# EAGLE design platform (EAGLE 5.04)
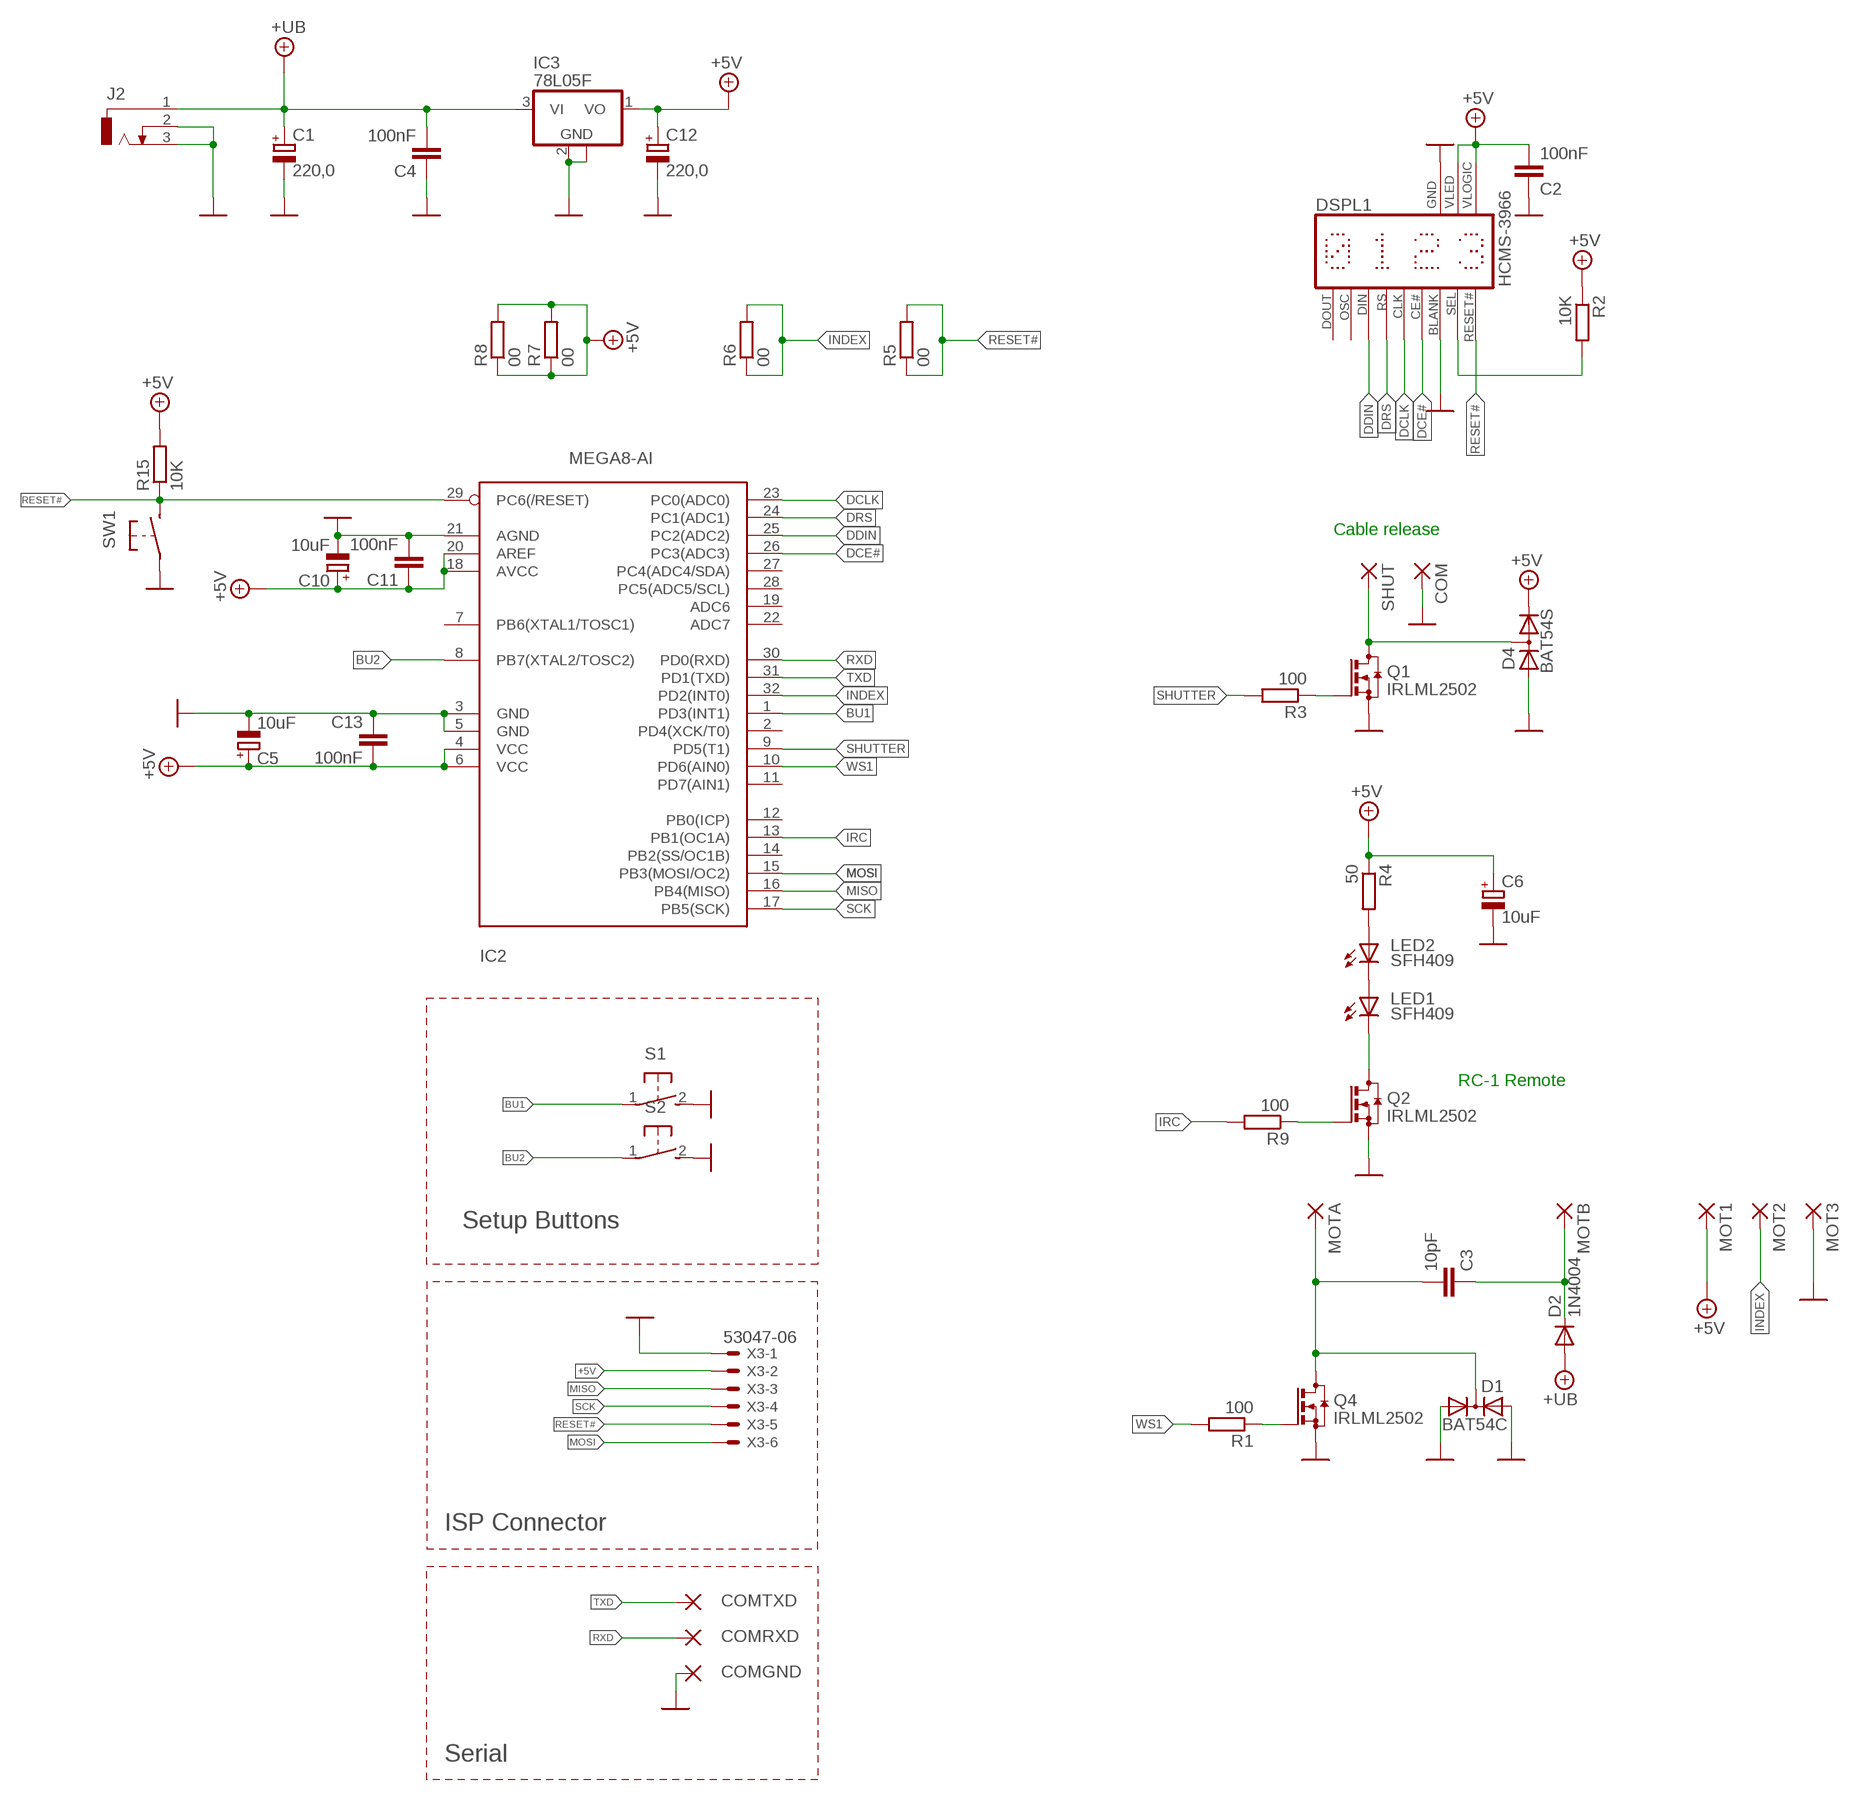
[diagram p0: schematic, sheet 1]

## Parts
C1  220,0  CPOL-EUC  [PANASONIC_C]
C2  100nF  C-EUC0603K  [C0603K]
C3  10pF  C-EUC0603K  [C0603K]
C4  100nF  C-EUC0603K  [C0603K]
C5  10uF  CPOL-EUSMCB  [SMC_B]
C6  10uF  CPOL-EUSMCB  [SMC_B]
C10  10uF  CPOL-EUSMCB  [SMC_B]
C11  100nF  C-EUC0603K  [C0603K]
C12  220,0  CPOL-EUD/7343-31R  [D/7343-31R]
C13  100nF  C-EUC0603K  [C0603K]
COM  1,6/0,8  [1,6/0,8]
COMGND  1,6/0,8  [1,6/0,8]
COMRXD  1,6/0,8  [1,6/0,8]
COMTXD  1,6/0,8  [1,6/0,8]
D1  BAT54C  DIODE-2AC|CASOT23  [SOT23@1]
D2  1N4004  [DO41-10]
D4  BAT54S  DIODE_2CACA-SOT23  [SOT23]
DSPL1  HCMS-3966  [HCMS3]
IC2  MEGA8-AI  [TQFP32-08]
IC3  78L05F  [SOT89]
J2  DCJ-SMALL  [DCJ-SMALL]
LED1  SFH409  LED3MM  [LED3MM]
LED2  SFH409  LED3MM  [LED3MM]
MOT1  1,6/0,8  [1,6/0,8]
MOT2  1,6/0,8  [1,6/0,8]
MOT3  1,6/0,8  [1,6/0,8]
MOTA  1,6/0,8  [1,6/0,8]
MOTB  1,6/0,8  [1,6/0,8]
Q1  IRLML2502  BSS123  [SOT23]
Q2  IRLML2502  BSS123  [SOT23]
Q4  IRLML2502  BSS123  [SOT23]
R1  100  R-EU_R0805S  [R0805-SVO]
R2  10K  R-EU_R0805S  [R0805-SVO]
R3  100  R-EU_R0805S  [R0805-SVO]
R4  50  R-EU_R0805S  [R0805-SVO]
R5  00  R-EU_R0805S  [R0805-SVO]
R6  00  R-EU_R0805S  [R0805-SVO]
R7  00  R-EU_R0805S  [R0805-SVO]
R8  00  R-EU_R0805S  [R0805-SVO]
R9  100  R-EU_R0402  [R0402]
R15  10K  R-EU_R0805S  [R0805-SVO]
S1  31-XX  [B3F-31XX]
S2  31-XX  [B3F-31XX]
SHUT  1,6/0,8  [1,6/0,8]
SW1  BUTTON-IT_1181  [SW_IT1181]
X3  53047-06  [53047-06]

## Nets
+5V: C2.2 C5.+ C6.+ C10.+ C11.1 C12.+ C13.2 D4.2(C) DSPL1.3(VLED) DSPL1.11(VLOGIC) IC2.4(VCC) IC2.6(VCC) IC2.18(AVCC) IC2.20(AREF) IC3.1(VO) MOT1.1(P) R2.1 R4.1 R7.1 R7.2 R8.1 R8.2 R15.2 X3.2
+UB: C1.+ C4.2 D2.A IC3.3(VI) J2.1
BU1: IC2.1(PD3(INT1)) S1.1(P)
BU2: IC2.8(PB7(XTAL2/TOSC2)) S2.1(P)
DCE#: DSPL1.7(CE#) IC2.26(PC3(ADC3))
DCLK: DSPL1.6(CLK) IC2.23(PC0(ADC0))
DDIN: DSPL1.4(DIN) IC2.25(PC2(ADC2))
DRS: DSPL1.5(RS) IC2.24(PC1(ADC1))
GND: C1.- C2.1 C4.1 C5.- C6.- C10.- C11.2 C12.- C13.1 COM.1(P) COMGND.1(P) D1.1(A1) D1.2(A2) D4.1(A) DSPL1.8(BLANK) DSPL1.9(GND) IC2.3(GND) IC2.5(GND) IC2.21(AGND) IC3.2(GND) IC3.2@1(GND) J2.2 J2.3 MOT3.1(P) Q1.2(S) Q2.2(S) Q4.2(S) S1.2(S) S2.2(S) SW1.P$1(P1) X3.1
INDEX: IC2.32(PD2(INT0)) MOT2.1(P) R6.1 R6.2
IRC: IC2.13(PB1(OC1A)) R9.2
MISO: IC2.16(PB4(MISO)) X3.3
MOSI: IC2.15(PB3(MOSI/OC2)) X3.6
N$1: Q4.1(G) R1.1
N$2: C3.1 D2.C MOTB.1(P)
N$3: Q1.1(G) R3.1
N$4: D4.3(AC) Q1.3(D) SHUT.1(P)
N$5: LED1.A LED2.K(C)
N$6: LED2.A R4.2
N$7: Q2.1(G) R9.1
N$8: C3.2 D1.3(C) MOTA.1(P) Q4.3(D)
N$9: LED1.K(C) Q2.3(D)
N$13: DSPL1.10(SEL) R2.2
RESET#: DSPL1.12(RESET#) IC2.29(PC6(/RESET)) R5.1 R5.2 R15.1 SW1.P$2(P2) X3.5
RXD: COMRXD.1(P) IC2.30(PD0(RXD))
SCK: IC2.17(PB5(SCK)) X3.4
SHUTTER: IC2.9(PD5(T1)) R3.2
TXD: COMTXD.1(P) IC2.31(PD1(TXD))
WS1: IC2.10(PD6(AIN0)) R1.2
Unconnected: DSPL1.1(DOUT) DSPL1.2(OSC) IC2.2(PD4(XCK/T0)) IC2.7(PB6(XTAL1/TOSC1)) IC2.11(PD7(AIN1)) IC2.12(PB0(ICP)) IC2.14(PB2(SS/OC1B)) IC2.19(ADC6) IC2.22(ADC7) IC2.27(PC4(ADC4/SDA)) IC2.28(PC5(ADC5/SCL))

## Notes on the sheet
- Cable release
- RC-1 Remote
- Setup Buttons
- ISP Connector
- Serial

## Library data of the parts
C1 C5 C6 C10 C12 = rcl:CPOL-EU: POLARIZED CAPACITOR, European symbol
C2-C4 C11 C13 = rcl:C-EU: CAPACITOR, European symbol
COM COMGND COMRXD COMTXD MOT1-MOT3 MOTA MOTB SHUT = wirepad:1,6/0,8: THROUGH-HOLE PAD
D1 = diode:DIODE-2AC|CA: Dual DIODE Anode-Cathode|Cathode-Anode
D2 = diode:1N4004: DIODE general purpose rectifier, 1 A
D4 = diode:DIODE_2CACA-: 2 Diodes - Cathode-Anode|Cathode-Anode
DSPL1 = 0-display-hcms:HCMS-3966: Agilent HCMS-39x6 and HCMS-39x7 3.3 V High Performance CMOS 5x7 AlphaNumeric Displays
IC2 = atmel:MEGA8: MICROCONTROLLER 8 Kbytes FLASH, 1 kbytes SRAM, 512 bytes EEPROM, USART, 6-channel 10 bit ADC, 2-channel 8 bit ADC Pin compatible with Atmega48, ATMega88, ATMega168 Source: avr.lbr
IC3 = linear:78L*: POSITOIV-VOLTAGE REGULATORS Output up to 100 mA Source: http://focus.ti.com/lit/ds/symlink/ua78l05.pdf
J2 = 0-svo:DCJ-SMALL: Smaller DC power jack
LED1 LED2 = 0-svo:LED: LED OSRAM: - CHIPLED LG R971, LG N971, LY N971, LG Q971, LY Q971, LO R971, LY R971 LH N974, LH R974 LS Q976, LO Q976, LY Q976 LO Q996 - Hyper CHIPLED LW Q18S LB Q993, LB Q99A, LB R99A - SideLED LS A670, LO A670, LY A670, LG A670, LP A670 LB A673, LV A673, LT A673, LW A673 LH A674 LY A675 LS A676, LA A676, LO A676, LY A676, LW A676 LS A679, LY A679, LG A679 - Hyper Micro SIDELED® LS Y876, LA Y876, LO Y876, LY Y876 LT Y87S - SmartLED LW L88C, LW L88S LB L89C, LB L89S, LG L890 LS L89K, LO L89K, LY L89K LS L896, LA L896, LO L896, LY L896 - TOPLED LS T670, LO T670, LY T670, LG T670, LP T670 LSG T670, LSP T670, LSY T670, LOP T670, LYG T670 LG T671, LOG T671, LSG T671 LB T673, LV T673, LT T673, LW T673 LH T674 LS T676, LA T676, LO T676, LY T676, LB T676, LH T676, LSB T676, LW T676 LB T67C, LV T67C, LT T67C, LS T67K, LO T67K, LY T67K, LW E67C LS E67B, LA E67B, LO E67B, LY E67B, LB E67C, LV E67C, LT E67C LW T67C LS T679, LY T679, LG T679 LS T770, LO T770, LY T770, LG T770, LP T770 LB T773, LV T773, LT T773, LW T773 LH T774 LS E675, LA E675, LY E675, LS T675 LS T776, LA T776, LO T776, LY T776, LB T776 LHGB T686 LT T68C, LB T68C - Hyper Mini TOPLED® LB M676 - Mini TOPLED Santana® LG M470 LS M47K, LO M47K, LY M47K Source: http://www.osram.convergy.de/
Q1 Q2 Q4 = transistor-small-signal:BSS123: N-CHANNEL MOS FET
R1-R9 R15 = rcl:R-EU_: RESISTOR, European symbol
S1 S2 = switch-omron:31-XX: OMRON SWITCH
SW1 = 0-svo:BUTTON-IT_1181
X3 = con-molex:53?-06: CONNECTOR wire to board 1.25 mm (.049 inch) pitch header

## Net classes
0 default: width 0.3 mm, drill 0.6 mm, clearance 0.25 mm

## Board
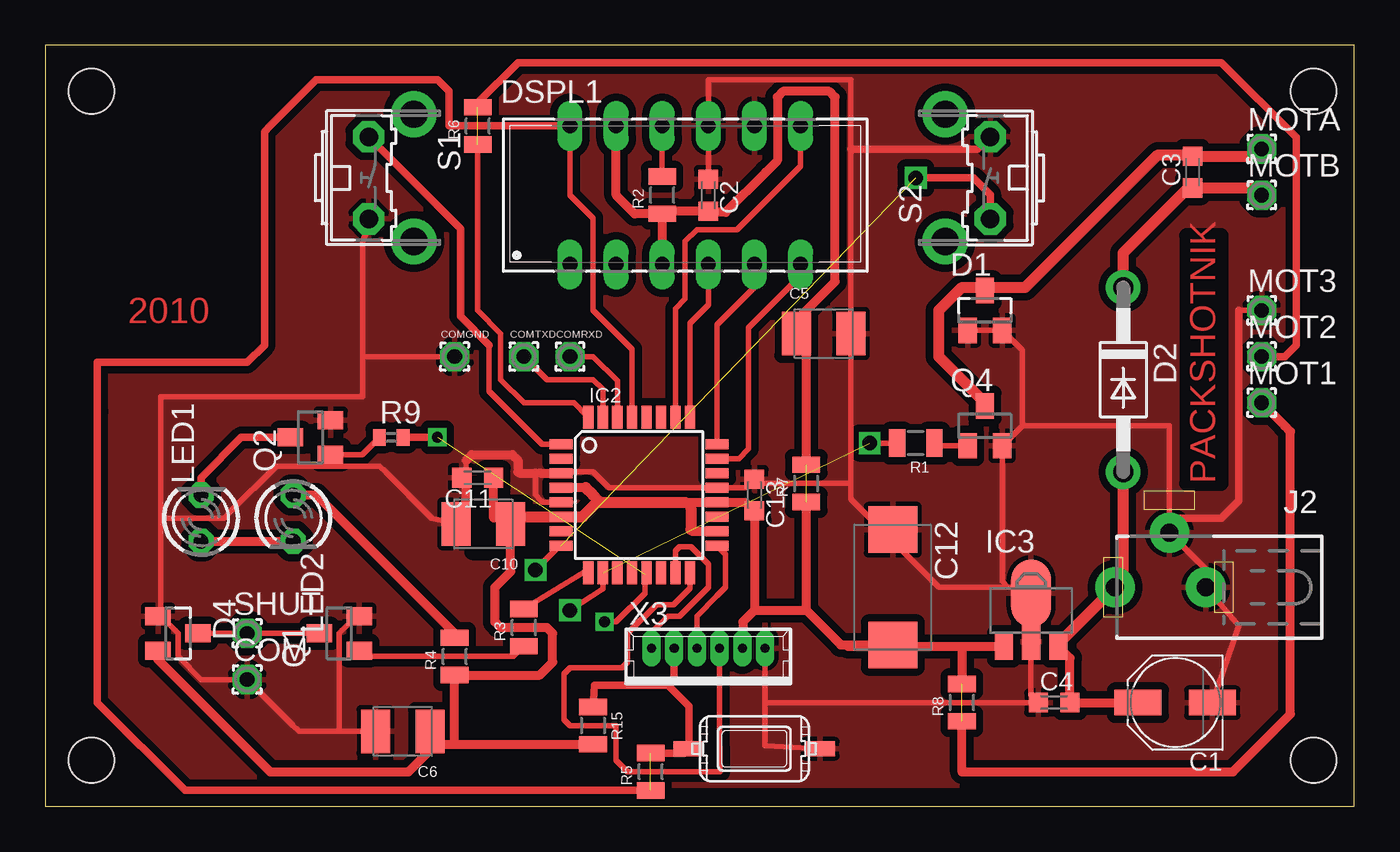
[diagram p1: board, top side]
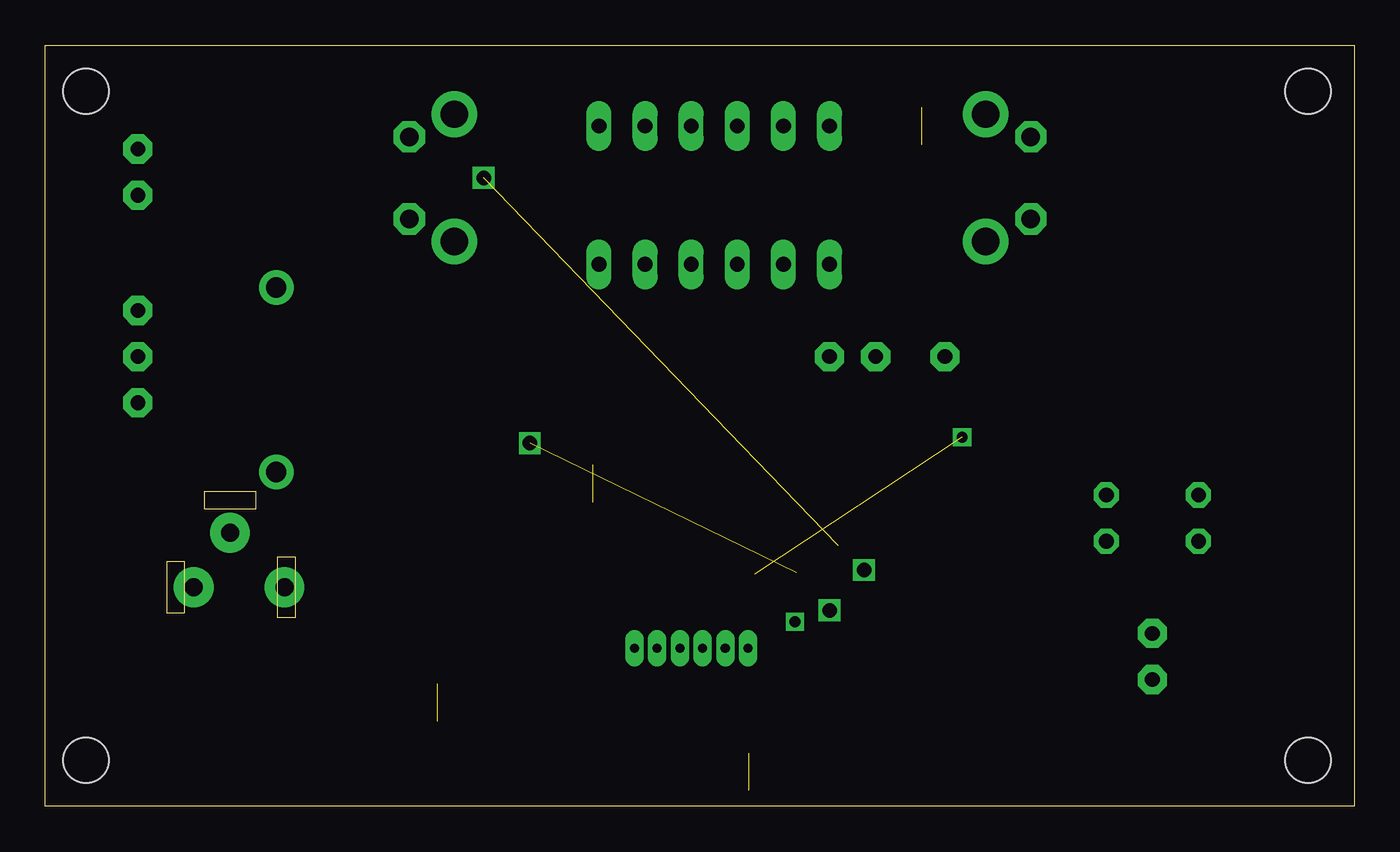
[diagram p2: board, bottom side, seen from below]

Size 72.08 x 41.9 mm. Coordinates in mm from the lower left corner, seen from the top.
Outline: 0,0 72.08,0 72.08,41.9 0,41.9 0,0
Copper layers (1*16): Top 0.035mm / dielectric 1.5mm / Bottom 0.035mm
Design rules "default *": minimum track width 10mil, minimum drill 24mil, track to track 8mil, track to pad 8mil, pad to pad 8mil, via to via 8mil, smd to smd 8mil, copper to edge 40mil, drill to drill 8mil, minimum pad ring 10mil, minimum via ring 8mil, stop-mask expansion 4mil, vias tented up to drill 0mil, thermal gap 10mil
Holes 2.5 mm at 2.54,39.37 2.54,2.54 69.85,2.54 69.85,39.37
tRestrict: area 2.3,26.1 to 10.9,37.7; area 62.9,17.8 to 64.8,31.4; area 46.7,19.4 to 48.9,20.6; area 50.5,27 to 52.1,27.6; area 23.5,14 to 24.8,17.8

### Footprints (pad centres in the part's own frame; a part is rotated, then mirrored left to right if it is on the bottom)
PANASONIC_C = smd 2.6 x 1.4: + 2.05,0; - -2.05,0
C0603K = smd 1.05 x 1.08: 1 -0.875,0; 2 0.875,0
SMC_B = smd 1.6 x 2.4: + -1.5,0; - 1.5,0
D/7343-31R = smd 2.55 x 2.7: + 3.175,0; - -3.175,0
1,6/0,8 = drill 0.813 pad 1.6 octagon: 1 0,0
SOT23@1 = smd 1 x 1.4: 1 -0.95,-1.1; 2 0.95,-1.1; 3 0,1.1
DO41-10 = drill 1.118 round: A 5.08,0; C -5.08,0
SOT23 = smd 1 x 1.4: 1 -0.95,-1.1; 2 0.95,-1.1; 3 0,1.1
HCMS3 = drill 0.813 long: 1 -6.35,-3.81; 2 -3.81,-3.81; 3 -1.27,-3.81; 4 1.27,-3.81; 5 3.81,-3.81; 6 6.35,-3.81; 7 6.35,3.81; 8 3.81,3.81; 9 1.27,3.81; 10 -1.27,3.81; 11 -3.81,3.81; 12 -6.35,3.81
TQFP32-08 = smd 1.27 x 0.559: 1 -4.293,2.8; 2 -4.293,2; 3 -4.293,1.2; 4 -4.293,0.4; 5 -4.293,-0.4; 6 -4.293,-1.2; 7 -4.293,-2; 8 -4.293,-2.8; 17 4.293,-2.8; 18 4.293,-2; 19 4.293,-1.2; 20 4.293,-0.4; 21 4.293,0.4; 22 4.293,1.2; 23 4.293,2; 24 4.293,2.8 | smd 0.559 x 1.27: 9 -2.8,-4.293; 10 -2,-4.293; 11 -1.2,-4.293; 12 -0.4,-4.293; 13 0.4,-4.293; 14 1.2,-4.293; 15 2,-4.293; 16 2.8,-4.293; 25 2.8,4.293; 26 2,4.293; 27 1.2,4.293; 28 0.4,4.293; 29 -0.4,4.293; 30 -1.2,4.293; 31 -2,4.293; 32 -2.8,4.293
SOT89 = smd 1 x 1.5: 1 -1.499,-1.981; 3 1.499,-1.981 | smd 1 x 2: 2 0,-1.727 | smd 2.2 x 3.7: 2@1 0,0.94
DCJ-SMALL = drill 1 pad 2.184 round: 1 0,3; 2 3,0; 3 0,-2
LED3MM = drill 0.813 octagon: A -1.27,0; K 1.27,0
R0805-SVO = smd 0.9 x 1.524: 1 -1.027,0; 2 1.027,0
R0402 = smd 0.7 x 0.9: 1 -0.65,0; 2 0.65,0
B3F-31XX = drill 1.016 octagon: 1 -2.261,-1.245; 2 2.261,-1.245 | drill 1.499 pad 2.159 round: 3 -3.505,1.245; 4 3.505,1.245
SW_IT1181 = smd 1.676 x 0.813: P$1 -3.61,0; P$2 3.61,0
53047-06 = drill 0.5 pad 0.698 long: 1 3.125,0.45; 2 1.875,0.45; 3 0.625,0.45; 4 -0.625,0.45; 5 -1.875,0.45; 6 -3.125,0.45

### Placement (x,y rotation side)
C1  62.23,5.71 180 top
C2  36.51,33.66 270 top
C3  63.18,34.92 90 top
C4  55.56,5.71 0 top
C5  42.86,26.04 0 top
C6  19.68,4.13 180 top
C10  24.13,15.56 180 top
C11  23.81,18.1 180 top
C12  46.67,12.06 270 top
C13  39.05,17.14 270 top
COM  11.11,6.99 0 top
COMGND  22.54,24.77 0 top
COMRXD  28.89,24.77 0 top
COMTXD  26.35,24.77 0 top
D1  51.75,27.3 0 top
D2  59.37,23.5 270 top
D4  7.3,9.53 270 top
DSPL1  35.24,33.66 0 top
IC2  32.7,17.14 0 top
IC3  54.29,10.79 0 top
J2  61.91,12.06 90 top
LED1  8.57,15.88 90 top
LED2  13.65,15.88 270 top
MOT1  66.99,22.23 0 top
MOT2  66.99,24.77 0 top
MOT3  66.99,27.3 0 top
MOTA  66.99,36.2 0 top
MOTB  66.99,33.66 0 top
Q1  16.19,9.53 90 top
Q2  14.61,20.32 90 top
Q4  51.75,20.95 0 top
R1  47.94,20 180 top
R2  33.97,33.66 90 top
R3  26.35,9.84 90 top
R4  22.54,8.26 90 top
R5  33.34,1.91 90 top
R6  23.81,37.47 90 top
R7  41.91,17.78 90 top
R8  50.48,5.71 90 top
R9  19.05,20.32 0 top
R15  30.16,4.45 270 top
S1  19.05,34.61 270 top
S2  50.8,34.61 90 top
SHUT  11.11,9.53 0 top
SW1  39.05,3.17 180 top
X3  36.51,8.26 0 top

### Tracks (layer width: path | path; a pad name or v marks a point on that pad's centre or on a via)
+5V  (2 unrouted)
  Top 0.305: 30.48,16.83 30.56,16.75 | 35.56,15.24 35.66,15.14 | 35.24,16.75 35.56,16.43 | 38.58,16.75 C13.2 | 38.42,8.73 X3.2 | C10.+ 25.96,16.2 | C10.+ 25.7,15.95 | C10.+ 24.69,15.87 | C6.+ 21.7,3.61 21.89,3.42 | 34.12,32.78 R2.1 | 41.36,26.76 C5.+ 41.91,25.49 | 36.59,32.7 C2.2
  Top 0.5: 29.76,17.55 IC2.4 | 35.24,16.75 IC2.20 38.58,16.75 | 35.66,15.14 IC2.18 | 41.91,10.79 43.81,8.89 C12.+ 44.21,8.81 50.48,8.81 | 39.05,10.79 41.91,10.79 | 39.05,10.79 38.42,10.16 38.42,8.73 | C13.2 39.05,10.79 | 50.48,8.81 IC3.1 | R15.2 26.35,3.42 22.54,3.42 | 24.69,15.87 C11.1 | 21.89,3.42 22.54,3.42 | 22.54,3.42 R4.1 27.23,7.23 27.94,7.94 27.94,9.53 27.62,9.84 25.08,9.84 24.77,10.16 24.77,12.06 25.63,12.93 C10.+ | D4.2 6.2,8.09 12.38,1.91 20,1.91 21.7,3.61 | DSPL1.3 R2.1 32.46,32.63 31.43,33.66 DSPL1.11 | 34.12,32.78 C2.2 36.59,32.7 37.47,32.7 39.69,34.92 40.32,35.56 40.32,39.05 40.64,39.37 43.18,39.37 43.5,39.05 43.5,28.89 41.36,26.76 | 41.91,10.79 R7.1 | R7.2 41.91,25.49 | 50.48,8.81 R8.2 | R8.1 50.48,1.91 63.18,1.91 65.41,1.91 68.58,5.08 68.58,20.64 68.26,20.95 MOT1.1
  Top 0.61: 29.76,17.55 30.16,17.14 30.48,16.83 29.6,15.95 IC2.6 26.21,15.95 25.96,16.2 | 30.56,16.75 35.24,16.75 | 35.56,16.43 35.56,15.24
+UB
  Top 0.305: IC3.3 55.79,8.94 | J2.1 59.37,12.53
  Top 0.5: IC3.3 56.44,8.17 C4.2 C1.+
  Top 0.61: 55.79,8.94 J2.1 | 59.37,12.53 D2.A
BU1
  Top 0.305: IC2.1 27.36,19.95 24.45,22.86 24.45,25.4
  Top 0.406: 24.45,25.4 22.86,26.99 22.86,31.81 S1.1
BU2  (via drill 0.8)  (1 unrouted)
  Top 0.305: IC2.8 28.32,14.35 v26.99,13.02
  Top 0.406: S2.1 52.05,33.68 51.12,34.61 v47.94,34.61
  Bottom 0.305: v26.99,13.02 26.99,12.7
DCE#
  Top 0.305: IC2.26 34.7,27.4 35.24,27.94 35.24,31.11 35.88,31.75 37.78,31.75 38.1,31.75 39.05,32.7 41.59,35.24 DSPL1.7
DCLK
  Top 0.305: IC2.23 38.2,19.14 38.73,19.68 38.73,26.35 41.59,29.21 DSPL1.6
DDIN
  Top 0.305: IC2.25 35.5,26.61 36.51,27.62 DSPL1.4
DRS
  Top 0.305: IC2.24 36.99,26.52 39.05,28.57 DSPL1.5
GND
  Top 0.305: IC2.3 28.48,18.41 30.16,18.41 31.03,17.55 IC2.21 38.58,17.55 C13.1 39.29,17.78 40.64,17.78 44.36,17.78 | 46.04,15.24 C12.- 46.04,15.24 | SW1.P$1 39.64,3.34 X3.1 39.64,5.76 39.69,5.71 C4.1 54.29,6.11 IC3.2 | 46.04,15.24 49.21,12.06 53.02,12.06 | 53.02,12.06 53.96,12.06 IC3.2@1 | 27.23,18.34 26.99,18.34 26.99,17.14 27.3,16.83 27.39,16.75 IC2.5 | 26.04,18.41 26.11,18.34 | 23.18,19.05 23.18,18.49 C11.2 23.18,18.34 | 23.18,16.83 22.63,16.28 C10.- 21.27,15.88 18.73,18.41 18.41,18.73 12.7,18.73 10.16,16.19 9.84,15.88 7.62,15.88 6.35,15.88 | 16.19,4.13 13.97,4.13 13.65,4.45 COM.1 8.57,6.99 7.3,8.26 7.3,9.53 6.35,10.47 D4.1 6.35,10.62 6.35,14.61 6.35,15.88 | 16.19,4.13 C6.- | Q1.2 17.14,10.47 16.19,9.53 16.19,4.13 | C2.1 DSPL1.9 36.51,40.01 44.36,40.01 44.36,36.17 C5.- 44.36,17.78 | C1.- 65.72,9.94 J2.3 63.91,13.06 J2.2 61.91,15.88 61.91,20.95 53.8,20.95 | D1.1 D1.2 53.8,25.11 53.8,20.95 | 53.02,12.06 52.7,12.38 Q4.2 53.8,20.95 | 65.72,27.3 MOT3.1 | S1.2 17.74,31.75 17.46,31.11 17.46,24.77 | 17.46,24.77 17.46,22.54 16.51,22.54 6.35,22.54 6.35,15.88 | 17.46,24.77 COMGND.1 | 44.36,17.78 44.36,16.91 46.04,15.24
  Top 0.406: 65.72,27.3 65.72,16.83 64.77,15.88 61.91,15.88 | 44.36,36.17 51.35,36.17 S2.2
  Top 0.5: 27.23,18.34 IC2.3 | 26.11,18.34 26.99,18.34 | 26.04,18.41 26.04,19.05 25.72,19.37 23.5,19.37 23.18,19.05 | 23.18,16.83 23.18,18.34
  pour Top (isolate 0.406): 0,41.91 72.39,41.91 72.39,0 0,0 -1.27,0 -1.27,41.91
INDEX  (1 unrouted)
  Top 0.305: R6.2 23.81,38.73 | R6.1 23.81,27.3 25.08,26.04 25.08,23.5 26.35,22.23 29.11,22.23 IC2.32
  Top 0.4: MOT2.1 68.26,24.77 68.9,25.4 68.9,36.83 64.77,40.96 26.04,40.96 23.81,38.73
IRC  (via drill 0.6)  (1 unrouted)
  Top 0.305: v30.8,10.16 31.43,10.16 33.02,11.75 33.02,12.77 IC2.13
  Top 0.406: R9.2 v21.59,20.32
MISO
  Top 0.305: X3.3 37.14,4.75 37.15,1.91 32.07,1.91 31.43,2.54 31.43,4.45 28.89,4.45 28.57,4.76 28.57,7.3 28.89,7.62 31.75,7.62 32.07,7.94 32.07,9.53 33.66,11.11 34.61,11.11 35.24,11.75 35.5,12.01 IC2.16
MOSI
  Top 0.305: IC2.15 34.7,14.06 34.92,14.29 35.56,14.29 36.51,13.34 36.51,12.06 35.56,11.11 34.92,10.48 34.29,10.48 33.34,9.53 33.34,8.76 X3.6
N$1
  Top 0.305: Q4.1 48.8,19.86 R1.1
N$2
  Top 0.305: 62.94,34.05 C3.1
  Top 0.5: 66.6,34.05 MOTB.1
  Top 0.61: C3.1 66.6,34.05 | 62.94,34.05 59.37,30.48 D2.C
N$3
  Top 0.305: Q1.1 17.29,8.43 17.46,8.26 25.79,8.26 R3.1
N$4
  Top 0.305: Q1.3 SHUT.1 D4.3
N$5
  Top 0.5: LED1.A LED2.K
N$6
  Top 0.305: 22.54,9.53 R4.2
  Top 0.5: 22.54,9.53 14.92,17.14 LED2.A
N$7
  Top 0.305: Q2.1 17.45,19.37 R9.1
N$8
  Top 0.305: Q4.3 51.75,22.23 | 51.58,28.57 D1.3 51.92,28.57 | 63.1,35.88 C3.2
  Top 0.5: 66.6,35.8 MOTA.1
  Top 0.61: 51.75,22.23 49.21,24.77 49.21,27.3 50.48,28.57 51.58,28.57 | 51.92,28.57 53.02,28.57 53.98,28.57 61.28,35.88 63.1,35.88 | C3.2 66.6,35.8
N$9
  Top 0.406: LED1.K 8.57,18.1 10.79,20.32 Q2.3
N$13
  Top 0.305: R2.2 DSPL1.10
RESET#  (1 unrouted)
  Top 0.305: 34.29,6.67 34.64,7.01 | DSPL1.12 28.89,33.66 30.16,32.38 30.16,27.3 32.3,25.16 IC2.29 | SW1.P$2 35.2,2.93
  Top 0.4: 34.64,7.01 X3.5 | R15.1 30.24,6.67 32.7,6.67 34.29,6.67 35.44,5.51 SW1.P$2 | 35.2,2.93 R5.2 | R5.1 7.69,0.88 2.86,5.71 2.86,21.73
  Top 0.406: 2.86,21.73 2.86,24.45 11.11,24.45 12.06,25.4 12.06,30.48 12.06,37.15 12.38,37.47 14.92,40.01 21.59,40.01 22.23,39.37 22.23,37.47 DSPL1.12
RXD
  Top 0.305: IC2.30 31.5,23.43 30.16,24.77 COMRXD.1
SCK
  Top 0.305: X3.4 35.88,8.71 35.88,10.48 36.99,11.6 37.47,12.06 37.47,13.88 IC2.17
SHUTTER
  Top 0.305: IC2.9 29.61,12.85 R3.2
TXD
  Top 0.305: IC2.31 30.7,22.95 30.16,23.5 27.62,23.5 COMTXD.1
WS1  (via drill 0.8)  (1 unrouted)
  Top 0.305: IC2.10 30.7,11.97 v28.89,10.79 | v45.4,20 R1.2

### Text on the board
Top: 2010 | PACKSHOTNIK